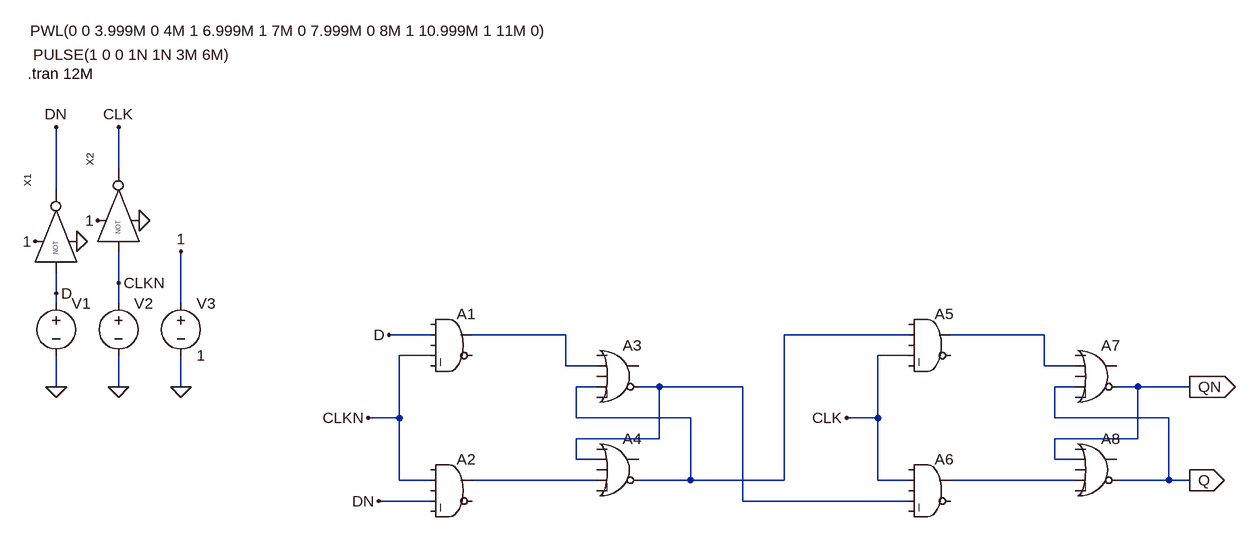
[diagram p0: schematic D_LATCH_SLAYTEXAMPLE_2FAIL.asc]
D_LATCH_SLAYTEXAMPLE_2FAIL.asc, the LTspice schematic file:
Version 4
SHEET 1 1280 680
WIRE -464 -272 -464 -336
WIRE -560 -240 -560 -336
WIRE -464 -96 -464 -144
WIRE -560 -80 -560 -112
WIRE -560 -64 -560 -80
WIRE -464 -64 -464 -96
WIRE -368 -64 -368 -144
WIRE 16 -16 -48 -16
WIRE 224 -16 80 -16
WIRE 752 -16 560 -16
WIRE 960 -16 816 -16
WIRE 16 16 -32 16
WIRE 752 16 704 16
WIRE 224 32 224 -16
WIRE 272 32 224 32
WIRE 960 32 960 -16
WIRE 1008 32 960 32
WIRE -560 64 -560 16
WIRE -464 64 -464 16
WIRE -368 64 -368 16
WIRE 272 64 240 64
WIRE 368 64 336 64
WIRE 496 64 368 64
WIRE 1008 64 976 64
WIRE 1104 64 1072 64
WIRE 1184 64 1104 64
WIRE -32 112 -32 16
WIRE -32 112 -80 112
WIRE 240 112 240 64
WIRE 416 112 240 112
WIRE 704 112 704 16
WIRE 704 112 656 112
WIRE 976 112 976 64
WIRE 1152 112 976 112
WIRE 368 144 368 64
WIRE 368 144 240 144
WIRE 1104 144 1104 64
WIRE 1104 144 976 144
WIRE 240 176 240 144
WIRE 272 176 240 176
WIRE 976 176 976 144
WIRE 1008 176 976 176
WIRE -32 208 -32 112
WIRE 16 208 -32 208
WIRE 272 208 80 208
WIRE 416 208 416 112
WIRE 416 208 336 208
WIRE 560 208 560 -16
WIRE 560 208 416 208
WIRE 704 208 704 112
WIRE 752 208 704 208
WIRE 1008 208 816 208
WIRE 1152 208 1152 112
WIRE 1152 208 1072 208
WIRE 1184 208 1152 208
WIRE 16 240 -64 240
WIRE 496 240 496 64
WIRE 752 240 496 240
FLAG -560 64 0
FLAG -464 64 0
FLAG -528 -160 0
FLAG -368 -144 1
FLAG -592 -160 1
FLAG -560 -336 DN
FLAG -560 -80 D
FLAG -464 -336 CLK
FLAG -80 112 CLKN
FLAG -48 -16 D
FLAG -64 240 DN
FLAG -368 64 0
FLAG -496 -192 1
FLAG -432 -192 0
FLAG 656 112 CLK
FLAG 1184 64 QN
IOPIN 1184 64 Out
FLAG 1184 208 Q
IOPIN 1184 208 Out
FLAG -464 -96 CLKN
SYMBOL Digital\\and 48 -64 R0
SYMATTR InstName A1
SYMBOL Digital\\and 48 160 R0
SYMATTR InstName A2
SYMBOL Digital\\or 304 -16 R0
SYMATTR InstName A3
SYMBOL Digital\\or 304 128 R0
SYMATTR InstName A4
SYMBOL voltage -560 -80 R0
WINDOW 3 -40 -404 Left 2
WINDOW 123 0 0 Left 0
WINDOW 39 0 0 Left 0
SYMATTR InstName V1
SYMATTR Value PWL(0 0 3.999M 0 4M 1 6.999M 1 7M 0 7.999M 0 8M 1 10.999M 1 11M 0)
SYMBOL voltage -464 -80 R0
WINDOW 3 -131 -367 Left 2
WINDOW 123 0 0 Left 0
WINDOW 39 0 0 Left 0
SYMATTR InstName V2
SYMATTR Value PULSE(1 0 0 1N 1N 3M 6M)
SYMBOL NOT4 -544 -176 R270
SYMATTR InstName X1
SYMBOL voltage -368 -80 R0
WINDOW 123 0 0 Left 0
WINDOW 39 0 0 Left 0
SYMATTR InstName V3
SYMATTR Value 1
SYMBOL NOT4 -448 -208 R270
SYMATTR InstName X2
SYMBOL Digital\\and 784 -64 R0
SYMATTR InstName A5
SYMBOL Digital\\and 784 160 R0
SYMATTR InstName A6
SYMBOL Digital\\or 1040 -16 R0
SYMATTR InstName A7
SYMBOL Digital\\or 1040 128 R0
SYMATTR InstName A8
TEXT -604 -418 Left 2 !.tran 12M

The netlist it stands for:
* D_LATCH_SLAYTEXAMPLE_2FAIL.asc
A1 0 D 0 CLKN 0 0 N001 0 AND
A2 0 CLKN 0 DN 0 0 N005 0 AND
A3 0 N001 0 N002 0 N004 0 0 OR
A4 0 N004 0 N005 0 N002 0 0 OR
V1 D 0 PWL(0 0 3.999M 0 4M 1 6.999M 1 7M 0 7.999M 0 8M 1 10.999M 1 11M 0)
V2 CLKN 0 PULSE(1 0 0 1N 1N 3M 6M)
XX1 D 1 0 DN NOT4  ; pins A VH VL OUT
V3 1 0 1
XX2 CLKN 1 0 CLK NOT4  ; pins A VH VL OUT
A5 0 N002 0 CLK 0 0 N003 0 AND
A6 0 CLK 0 N004 0 0 N006 0 AND
A7 0 N003 0 Q 0 QN 0 0 OR
A8 0 QN 0 N006 0 Q 0 0 OR
.tran 12M
.backanno
.end